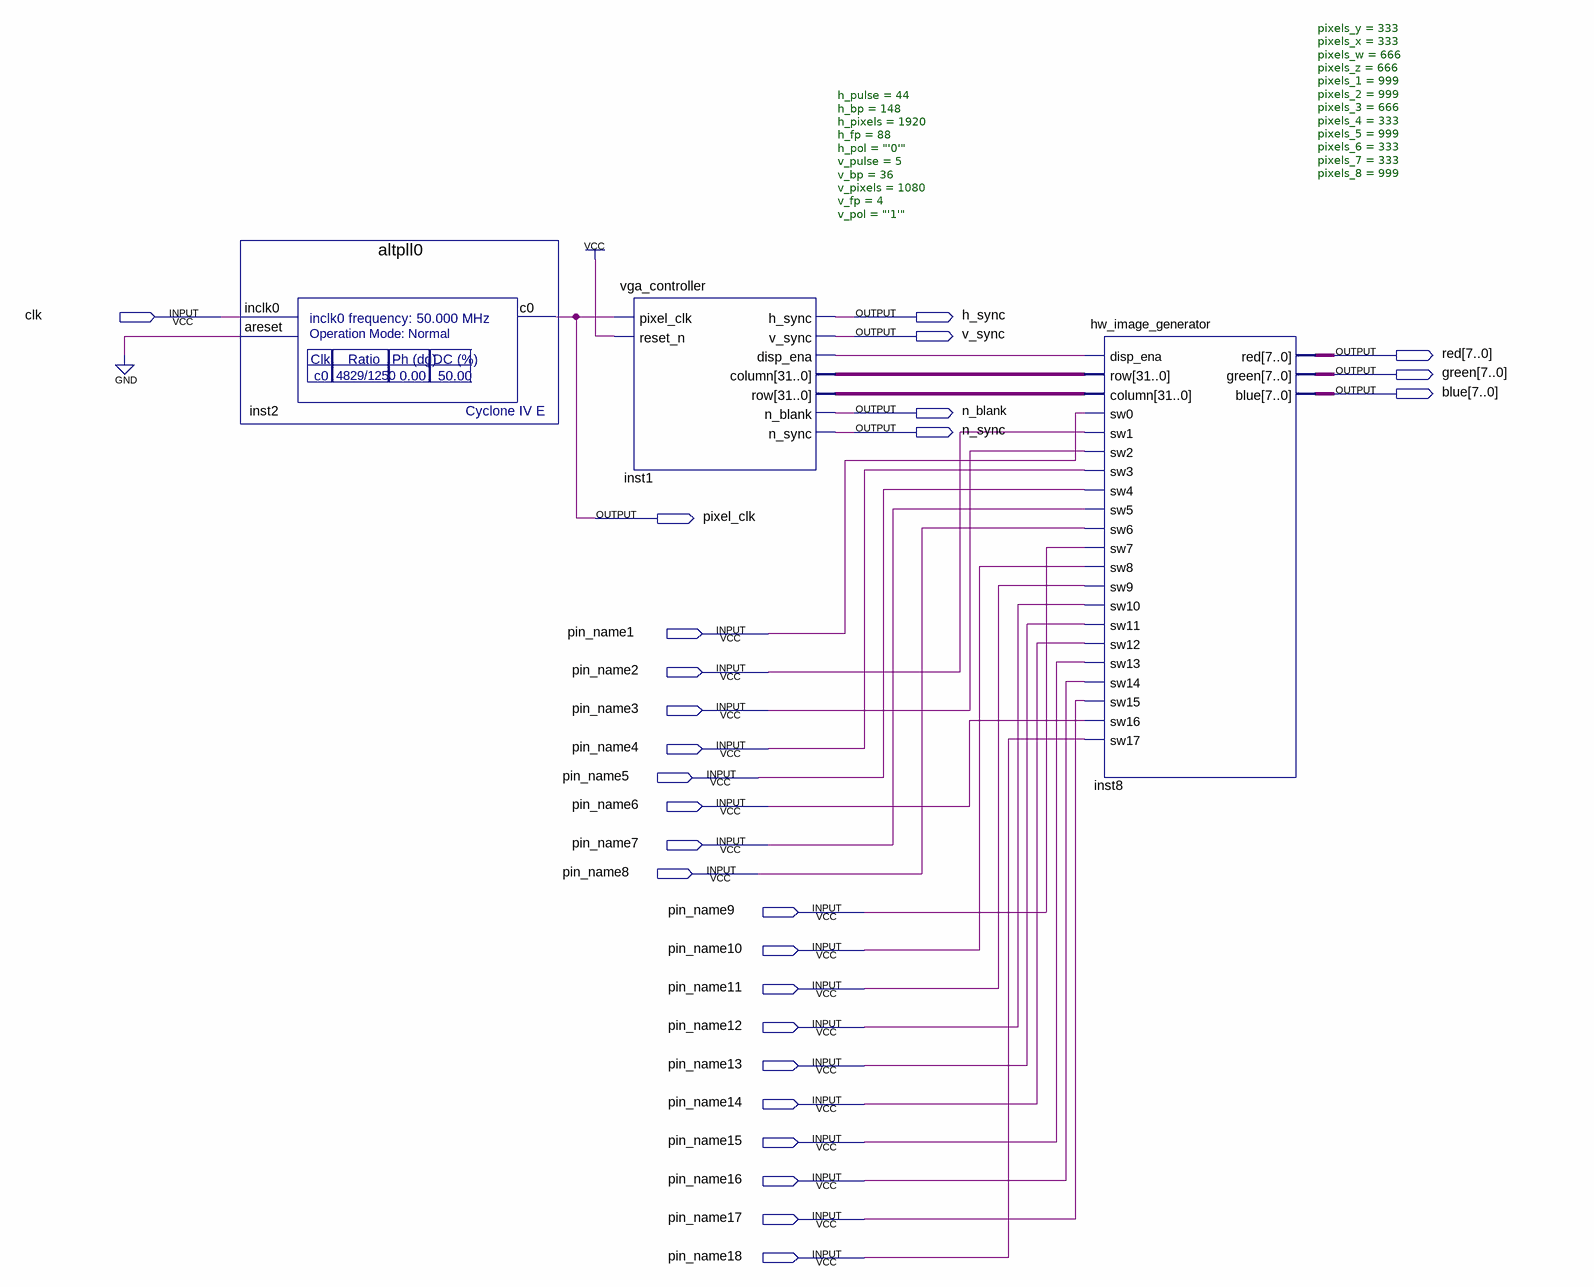
[diagram p0: schematic sheet]
// Quartus schematic vga_with_hw_test_image.bdf as structural Verilog: 3 symbols, 27 pins
module vga_with_hw_test_image (
  input  clk,
  input  pin_name1,
  input  pin_name2,
  input  pin_name3,
  input  pin_name4,
  input  pin_name5,
  input  pin_name6,
  input  pin_name7,
  input  pin_name8,
  input  pin_name9,
  input  pin_name10,
  input  pin_name11,
  input  pin_name12,
  input  pin_name13,
  input  pin_name14,
  input  pin_name15,
  input  pin_name16,
  input  pin_name17,
  input  pin_name18,
  output h_sync,
  output v_sync,
  output [7:0] red,
  output [7:0] green,
  output [7:0] blue,
  output n_blank,
  output n_sync,
  output pixel_clk
);

  wire inst1_disp_ena;
  wire [31:0] inst1_column, inst1_row;

  altpll0 inst2 (.inclk0(clk), .areset(1'b0), .c0(pixel_clk));
  vga_controller #(.h_pulse(44), .h_bp(148), .h_pixels(1920), .h_fp(88), .h_pol("'0'"), .v_pulse(5), .v_bp(36), .v_pixels(1080), .v_fp(4), .v_pol("'1'")) inst1 (
    .pixel_clk(pixel_clk), .reset_n(1'b1), .h_sync(h_sync), .v_sync(v_sync), .disp_ena(inst1_disp_ena),
    .column(inst1_column), .row(inst1_row), .n_blank(n_blank), .n_sync(n_sync));
  hw_image_generator #(.pixels_y(333), .pixels_x(333), .pixels_w(666), .pixels_z(666), .pixels_1(999), .pixels_2(999), .pixels_3(666), .pixels_4(333), .pixels_5(999), .pixels_6(333), .pixels_7(333), .pixels_8(999)) inst8 (
    .column(inst1_row), .disp_ena(inst1_disp_ena), .row(inst1_column), .sw0(pin_name1), .sw1(pin_name2),
    .sw10(pin_name12), .sw11(pin_name13), .sw12(pin_name14), .sw13(pin_name15), .sw14(pin_name16),
    .sw15(pin_name17), .sw16(pin_name6), .sw17(pin_name18), .sw2(pin_name3), .sw3(pin_name4),
    .sw4(pin_name5), .sw5(pin_name7), .sw6(pin_name8), .sw7(pin_name9), .sw8(pin_name10), .sw9(pin_name11),
    .blue(blue), .green(green), .red(red));
endmodule
